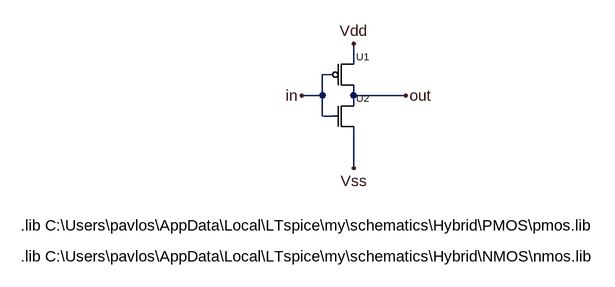
[diagram p0: schematic not.asc]
not.asc, the LTspice schematic file:
Version 4
SHEET 1 880 680
WIRE -80 -144 -80 -176
WIRE -112 -128 -128 -128
WIRE -128 -96 -128 -128
WIRE -128 -96 -160 -96
WIRE -80 -96 -80 -112
WIRE 0 -96 -80 -96
WIRE -80 -80 -80 -96
WIRE -128 -64 -128 -96
WIRE -112 -64 -128 -64
WIRE -80 16 -80 -48
FLAG 0 -96 out
FLAG -160 -96 in
FLAG -80 16 Vss
FLAG -80 -176 Vdd
SYMBOL pmos -112 -128 R0
SYMATTR InstName U1
SYMBOL nmos -112 -64 R0
SYMATTR InstName U2
TEXT -592 104 Left 2 !.lib C:\\Users\\pavlos\\AppData\\Local\\LTspice\\my\\schematics\\Hybrid\\PMOS\\pmos.lib
TEXT -592 152 Left 2 !.lib C:\\Users\\pavlos\\AppData\\Local\\LTspice\\my\\schematics\\Hybrid\\NMOS\\nmos.lib

The netlist it stands for:
* not.asc
XU1 in Vdd out pmos  ; pins G D S
XU2 in out Vss nmos  ; pins G D S
.lib C:\Users\pavlos\AppData\Local\LTspice\my\schematics\Hybrid\PMOS\pmos.lib
.lib C:\Users\pavlos\AppData\Local\LTspice\my\schematics\Hybrid\NMOS\nmos.lib
.backanno
.end